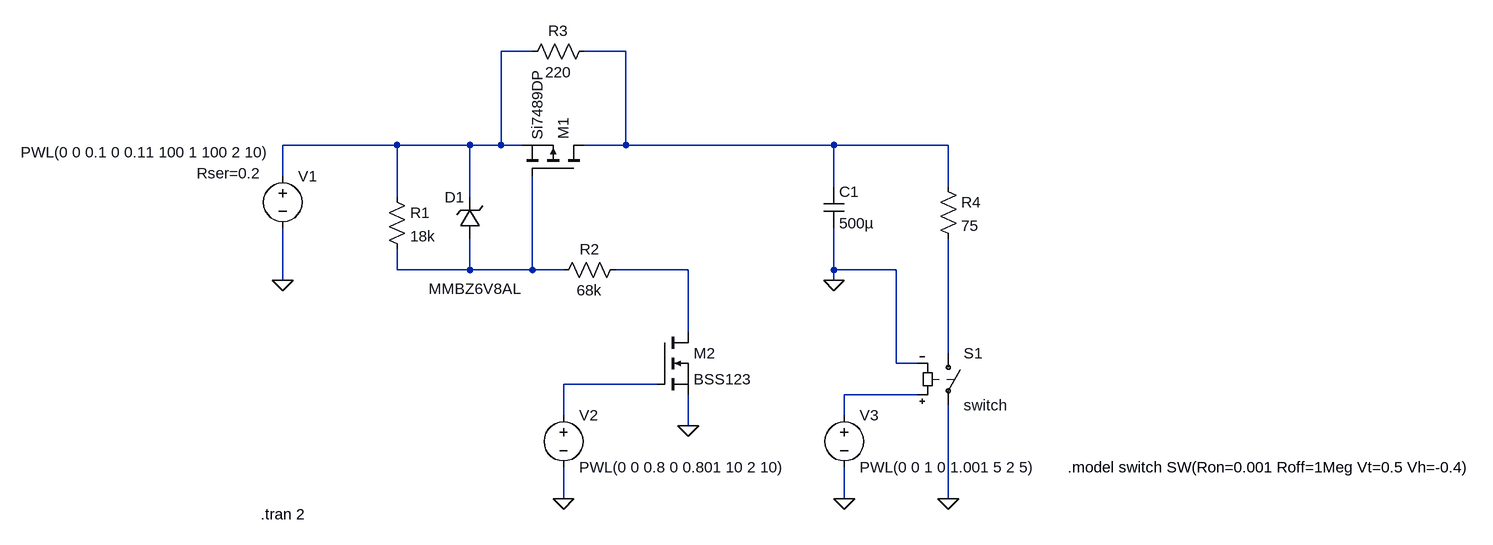
[diagram p0: schematic inrush_limit.asc]
inrush_limit.asc, the LTspice schematic file:
Version 4
SHEET 1 1944 712
WIRE 448 -16 400 -16
WIRE 592 -16 528 -16
WIRE 240 128 64 128
WIRE 352 128 240 128
WIRE 400 128 400 -16
WIRE 400 128 352 128
WIRE 432 128 400 128
WIRE 592 128 592 -16
WIRE 592 128 528 128
WIRE 912 128 592 128
WIRE 1088 128 912 128
WIRE 64 176 64 128
WIRE 912 192 912 128
WIRE 1088 192 1088 128
WIRE 240 208 240 128
WIRE 352 208 352 128
WIRE 240 320 240 288
WIRE 352 320 352 272
WIRE 352 320 240 320
WIRE 448 320 448 176
WIRE 448 320 352 320
WIRE 496 320 448 320
WIRE 688 320 576 320
WIRE 912 320 912 256
WIRE 1008 320 912 320
WIRE 64 336 64 256
WIRE 912 336 912 320
WIRE 688 416 688 320
WIRE 1088 448 1088 272
WIRE 1008 464 1008 320
WIRE 1040 464 1008 464
WIRE 640 496 496 496
WIRE 1040 512 928 512
WIRE 496 544 496 496
WIRE 928 544 928 512
WIRE 688 560 688 512
WIRE 496 672 496 624
WIRE 928 672 928 624
WIRE 1088 672 1088 528
FLAG 64 336 0
FLAG 912 336 0
FLAG 688 560 0
FLAG 496 672 0
FLAG 1088 672 0
FLAG 928 672 0
SYMBOL voltage 64 160 R0
WINDOW 3 -403 -21 Left 2
WINDOW 123 0 0 Left 2
WINDOW 39 -132 11 Left 2
SYMATTR InstName V1
SYMATTR Value PWL(0 0 0.1 0 0.11 100 1 100 2 10)
SYMATTR SpiceLine Rser=0.2
SYMBOL pmos 528 176 M270
SYMATTR InstName M1
SYMATTR Value Si7489DP
SYMBOL zener 368 272 R180
WINDOW 0 24 64 Left 2
WINDOW 3 -64 -77 Left 2
SYMATTR InstName D1
SYMATTR Value MMBZ6V8AL
SYMBOL res 224 192 R0
SYMATTR InstName R1
SYMATTR Value 18k
SYMBOL res 592 304 R90
WINDOW 0 0 56 VBottom 2
WINDOW 3 32 56 VTop 2
SYMATTR InstName R2
SYMATTR Value 68k
SYMBOL nmos 640 416 R0
SYMATTR InstName M2
SYMATTR Value BSS123
SYMBOL cap 896 192 R0
SYMATTR InstName C1
SYMATTR Value 500µ
SYMATTR SpiceLine Rser=0.08
SYMBOL res 544 -32 R90
WINDOW 0 0 56 VBottom 2
WINDOW 3 32 56 VTop 2
SYMATTR InstName R3
SYMATTR Value 220
SYMBOL voltage 496 528 R0
WINDOW 123 0 0 Left 2
WINDOW 39 0 0 Left 2
SYMATTR InstName V2
SYMATTR Value PWL(0 0 0.8 0 0.801 10 2 10)
SYMBOL res 1072 176 R0
SYMATTR InstName R4
SYMATTR Value 75
SYMBOL sw 1088 432 R0
SYMATTR InstName S1
SYMATTR Value switch
SYMBOL voltage 928 528 R0
WINDOW 123 0 0 Left 2
WINDOW 39 0 0 Left 2
SYMATTR InstName V3
SYMATTR Value PWL(0 0 1 0 1.001 5 2 5)
TEXT 30 696 Left 2 !.tran 2
TEXT 1272 624 Left 2 !.model switch SW(Ron=0.001 Roff=1Meg Vt=0.5 Vh=-0.4)

The netlist it stands for:
* inrush_limit.asc
V1 N001 0 PWL(0 0 0.1 0 0.11 100 1 100 2 10) Rser=0.2
M1 N002 N003 N001 N001 Si7489DP
D1 N003 N001 MMBZ6V8AL
R1 N001 N003 18k
R2 N004 N003 68k
M2 N004 N006 0 0 BSS123
C1 N002 0 500µ Rser=0.08
R3 N002 N001 220
V2 N006 0 PWL(0 0 0.8 0 0.801 10 2 10)
R4 N002 N005 75
S1 N005 0 N007 0 switch
V3 N007 0 PWL(0 0 1 0 1.001 5 2 5)
.model D D
.lib standard.dio
.model NMOS NMOS
.model PMOS PMOS
.lib standard.mos
.tran 2
.model switch SW(Ron=0.001 Roff=1Meg Vt=0.5 Vh=-0.4)
.backanno
.end